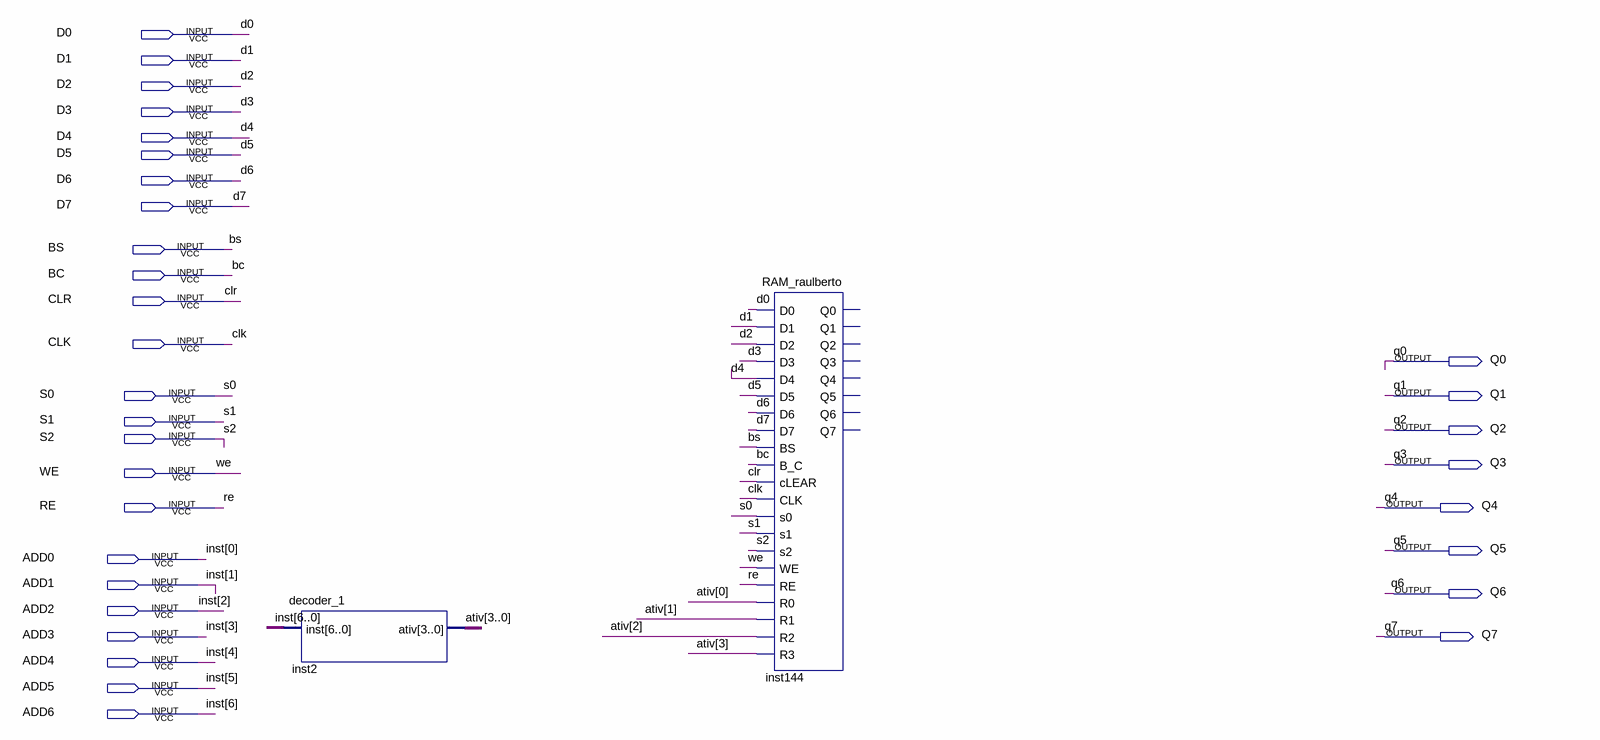
[diagram p0: schematic sheet]
// Quartus schematic RAM_beatrice.bdf as structural Verilog: 2 symbols, 32 pins
module RAM_beatrice (
  input  D0,
  input  D1,
  input  D2,
  input  D3,
  input  D4,
  input  D5,
  input  D6,
  input  D7,
  input  BS,
  input  BC,
  input  CLR,
  input  CLK,
  input  S0,
  input  S1,
  input  S2,
  input  WE,
  input  RE,
  input  ADD0,
  input  ADD1,
  input  ADD2,
  input  ADD3,
  input  ADD4,
  input  ADD5,
  input  ADD6,
  output Q0,
  output Q1,
  output Q2,
  output Q3,
  output Q4,
  output Q5,
  output Q6,
  output Q7
);

  wire [3:0] ativ;

  decoder_1 inst2 (.inst({ADD6, ADD5, ADD4, ADD3, ADD2, ADD1, ADD0}), .ativ(ativ));
  RAM_raulberto inst144 (
    .D0(D0), .D1(D1), .D2(D2), .D3(D3), .D4(D4), .D5(D5), .D6(D6), .D7(D7), .BS(BS), .B_C(BC), .cLEAR(CLR),
    .CLK(CLK), .s0(S0), .s1(S1), .s2(S2), .WE(WE), .RE(RE), .R0(ativ[0]), .R1(ativ[1]), .R2(ativ[2]),
    .R3(ativ[3]));  // open: Q0, Q1, Q2, Q3, Q4, Q5, Q6, Q7

  // Other names for the same wires on the sheet: inst[6:0] = {ADD6, ADD5, ADD4, ADD3, ADD2, ADD1, ADD0}
endmodule
